# EAGLE design Vorsignal (EAGLE 8.2.2)
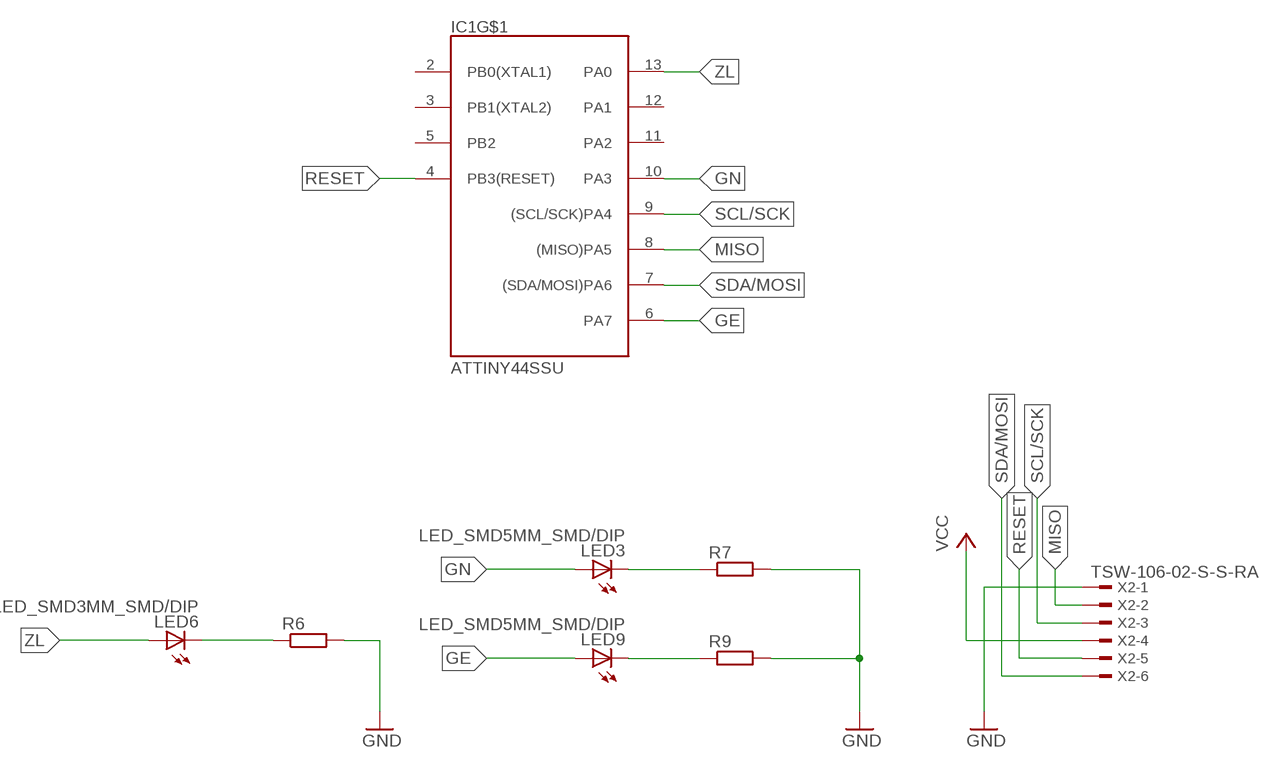
[diagram p0: schematic, sheet 1]

## Parts
IC1  ATTINY44SSU  [SO14]
LED3  LED_SMD5MM_SMD/DIP  [5MM_FLAT/DIP_SMDLED]
LED6  LED_SMD3MM_SMD/DIP  [3MM_FLAT/DIP_SMDLED]
LED9  LED_SMD5MM_SMD/DIP  [5MM_FLAT/DIP_SMDLED]
R6  R-EU_R0603  [R0603]
R7  R-EU_R0603  [R0603]
R9  R-EU_R0603  [R0603]
X2  TSW-106-02-S-S-RA  [TSW-106-02-S-S-RA]

## Nets
GE: IC1.6(PA7) LED9.+(A)
GN: IC1.10(PA3) LED3.+(A)
GND: R6.2 R7.2 R9.2 X2.1
MISO: IC1.8((MISO)PA5) X2.2
N$1: LED9.-(C) R9.1
N$2: LED6.-(C) R6.1
N$8: LED3.-(C) R7.1
RESET: IC1.4(PB3(RESET)) X2.5
SCL/SCK: IC1.9((SCL/SCK)PA4) X2.3
SDA/MOSI: IC1.7((SDA/MOSI)PA6) X2.6
VCC: X2.4
ZL: IC1.13(PA0) LED6.+(A)
Unconnected: IC1.2(PB0(XTAL1)) IC1.3(PB1(XTAL2)) IC1.5(PB2) IC1.11(PA2) IC1.12(PA1)

## Power pins joined to a net without a drawn wire
GND: IC1.14(GND)
VCC: IC1.1(VCC)

## Library data of the parts
IC1 = Attiny:ATTINY44: ATtiny24A/44A/84A are low-power CMOS 8-bit microcontrollers based on the AVR enhanced RISC architecture. By executing powerful in structions in a single clock cycle, the ATtiny24A/44A/84A achieves throughputs approaching 1 MIPS per MHz allowing the system designer to optimize power consum ption versus processing speed.
LED3 LED6 LED9 = LEDFLATTOP:LED_SMD: SMD LED 3/5mm für flat surface mount.
R6 R7 R9 = rcl:R-EU_: RESISTOR, European symbol
X2 = con-samtec:TSW-106-02-S-S: THROUGH-HOLE .025" SQ POST HEADER Source: Samtec TSW.pdf; OC_FARNELL: unknown; OC_NEWARK: unknown

## Board
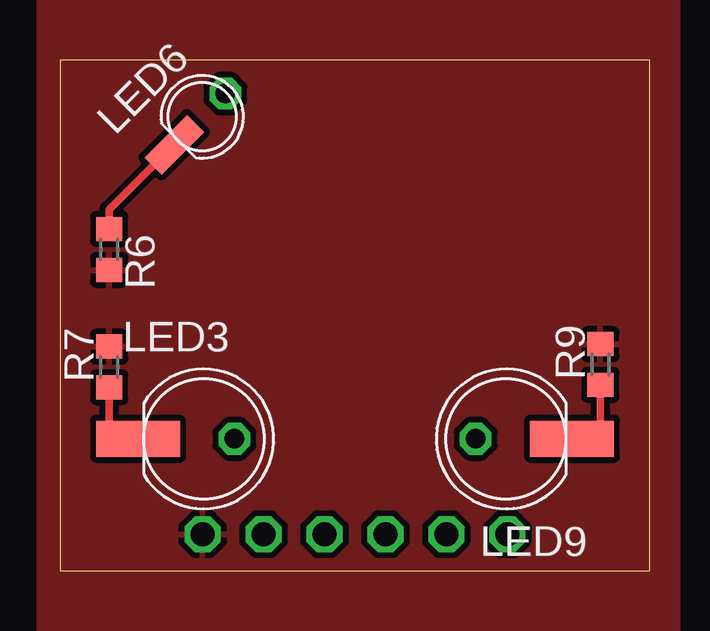
[diagram p1: board, top side]
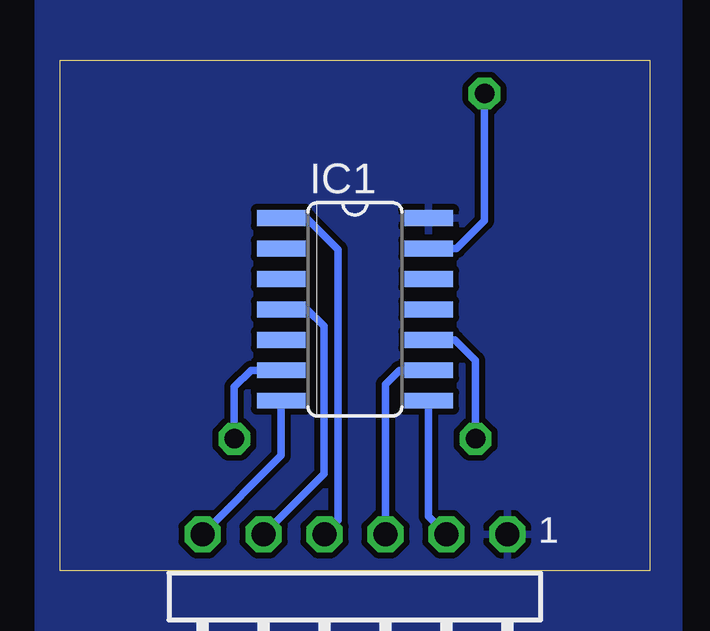
[diagram p2: board, bottom side, seen from below]

Size 24.6 x 21.3 mm. Coordinates in mm from the lower left corner, seen from the top.
Outline: 0,0 24.6,0 24.6,21.3 0,21.3 0,0
Copper layers (1*16): Top 0.035mm / dielectric 1.5mm / Bottom 0.035mm
Design rules "default *": minimum track width 6mil, minimum drill 0.35mm, track to track 10mil, track to pad 10mil, pad to pad 10mil, via to via 10mil, smd to smd 10mil, copper to edge 0mil, drill to drill 6mil, minimum pad ring 10mil, minimum via ring 8mil, stop-mask expansion 4mil, vias tented up to drill 0mil, thermal gap 10mil

### Footprints (pad centres in the part's own frame; a part is rotated, then mirrored left to right if it is on the bottom)
SO14 = smd 0.66 x 2.032: 1 -3.81,-3.073; 2 -2.54,-3.073; 3 -1.27,-3.073; 4 0,-3.073; 5 1.27,-3.073; 6 2.54,-3.073; 7 3.81,-3.073; 8 3.81,3.073; 9 2.54,3.073; 10 1.27,3.073; 11 0,3.073; 12 -1.27,3.073; 13 -2.54,3.073; 14 -3.81,3.073
5MM_FLAT/DIP_SMDLED = drill 0.813 octagon: + 1.27,0 | smd 3.5 x 1.5: - -2.75,0
3MM_FLAT/DIP_SMDLED = drill 0.813 octagon: + 1.27,0 | smd 2.5 x 1: - -1.75,0
R0603 = smd 1 x 1.1: 1 -0.85,0; 2 0.85,0
TSW-106-02-S-S-RA = drill 1 pad 1.5 octagon: 1 6.35,1.524; 2 3.81,1.524; 3 1.27,1.524; 4 -1.27,1.524; 5 -3.81,1.524; 6 -6.35,1.524

### Placement (x,y rotation side)
IC1  12.3,10.9 270 bottom
LED3  6,5.5 0 top
LED6  6,19 45 top
LED9  18.6,5.5 180 top
R6  2.05,13.4 270 top
R7  2.05,8.5 90 top
R9  22.53,8.6 90 top
X2  12.3,0 0 bottom

### Tracks (layer width: path | path; a pad name or v marks a point on that pad's centre or on a via)
GE
  Bottom 0.305: LED9.+ 17.33,7.67 16.64,8.36 IC1.6
GN
  Bottom 0.305: LED3.+ 7.27,8.77 8.13,9.63 IC1.10
GND
  pour Top: -0.9,25.7 25.8,26 25.8,-14.6 -0.9,-14.9
  pour Bottom: -1.2,25.6 -1.2,-15.2 25.5,-15.2 25.5,25.7 -0.6,25.7
MISO
  Bottom 0.305: X2.2 9.23,2.26 IC1.8
N$1
  Top 0.305: R9.1 22.53,5.5 LED9.-
N$2
  Top 0.305: LED6.- 2.05,15.05 R6.1
N$8
  Top 0.305: LED3.- 2.05,5.5 R7.1
RESET
  Bottom 0.305: X2.5 13.6,4.03 13.6,10.2 14.3,10.9 IC1.4
SCL/SCK
  Bottom 0.305: X2.3 11.03,7.77 10.44,8.36 IC1.9
SDA/MOSI
  Bottom 0.305: IC1.7 15.37,4.8 X2.6
VCC
  Bottom 0.305: X2.4 13,2.09 13,13.4 14.31,14.71 IC1.1
ZL
  Bottom 0.305: LED6.+ 6.9,14.6 8.06,13.44 IC1.13